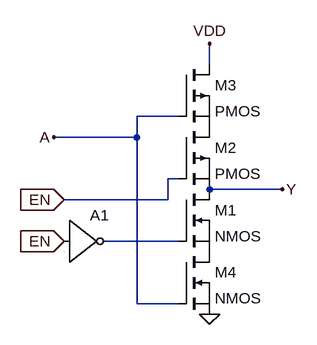
[diagram p0: schematic TRISTATE INVERTER.asc]
TRISTATE INVERTER.asc, the LTspice schematic file:
Version 4
SHEET 1 880 680
WIRE 208 -16 208 -48
WIRE 160 64 96 64
WIRE 96 96 96 64
WIRE 96 96 -32 96
WIRE 160 160 144 160
WIRE 320 176 208 176
WIRE 144 192 144 160
WIRE 144 192 -16 192
WIRE 160 256 48 256
WIRE 96 352 96 96
WIRE 160 352 96 352
FLAG 208 368 0
FLAG 208 -48 VDD
FLAG 320 176 Y
FLAG -32 96 A
FLAG -16 192 EN
IOPIN -16 192 In
FLAG -16 256 EN
IOPIN -16 256 In
SYMBOL nmos 160 176 R0
SYMATTR InstName M1
SYMBOL pmos 160 80 R0
SYMATTR InstName M2
SYMBOL pmos 160 -16 R0
SYMATTR InstName M3
SYMBOL nmos 160 272 R0
SYMATTR InstName M4
SYMBOL Digital\\inv -16 192 R0
SYMATTR InstName A1

The netlist it stands for:
* TRISTATE INVERTER.asc
M1 Y N001 P001 P001 NMOS
M2 P002 EN Y Y PMOS
M3 VDD A P002 P002 PMOS
M4 P001 A 0 0 NMOS
A1 EN 0 0 0 0 N001 0 0 BUF
.model NMOS NMOS
.model PMOS PMOS
.lib standard.mos
.backanno
.end